# EAGLE design pc386ram-nobuf (EAGLE 7.7.0)
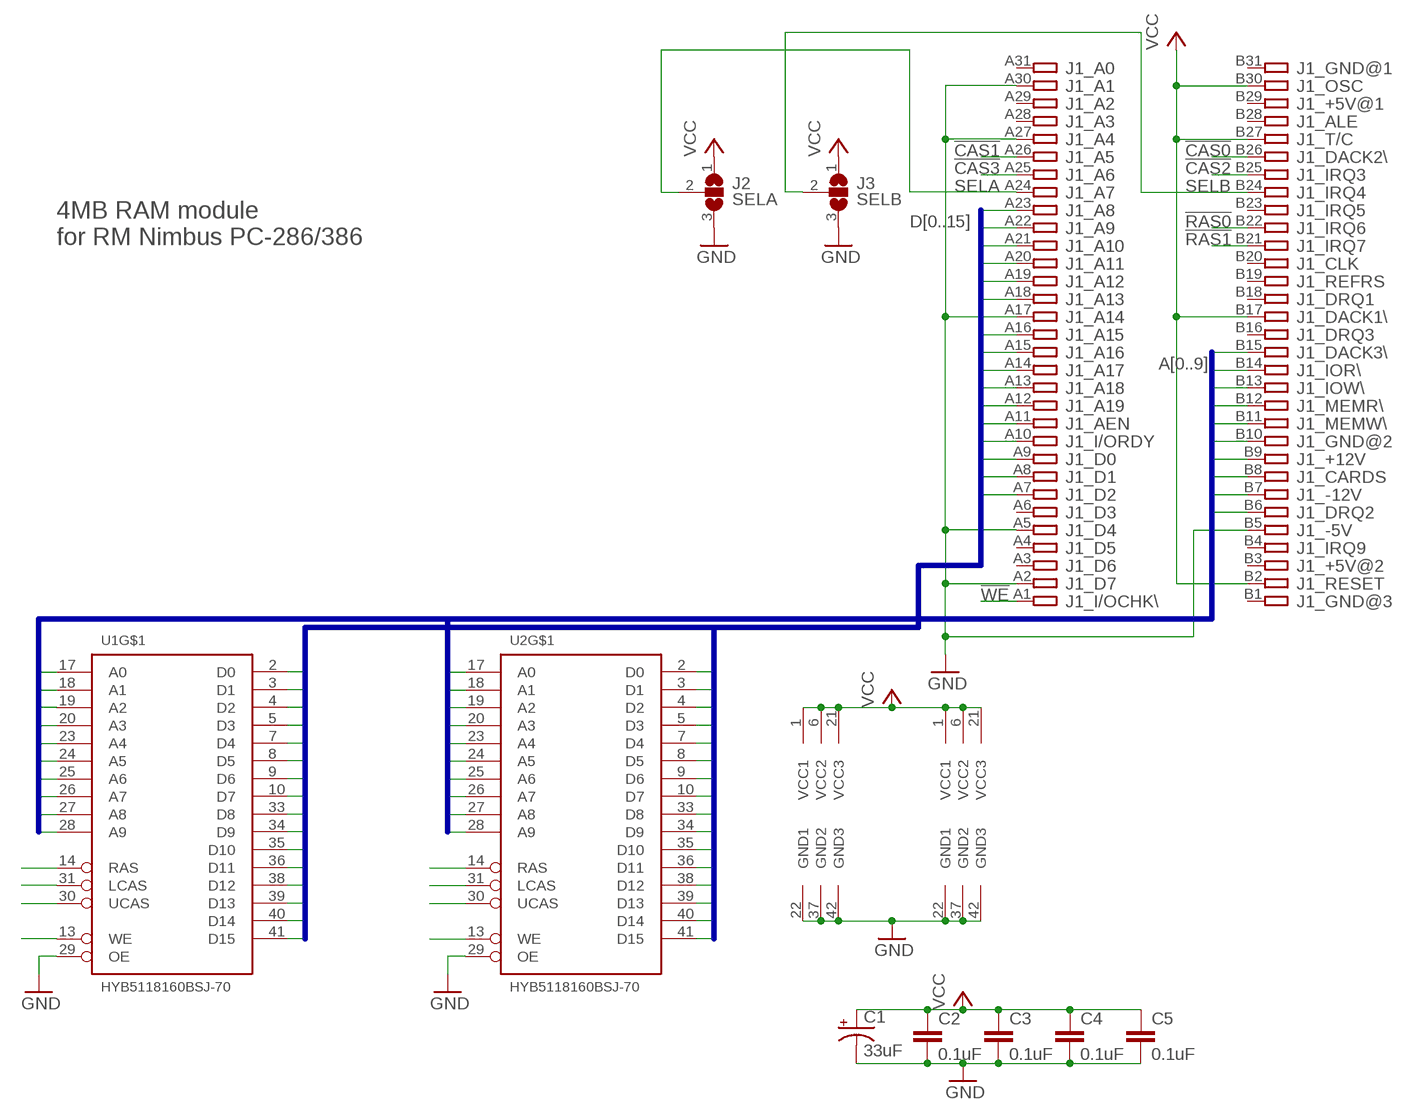
[diagram p0: schematic, sheet 1]

## Parts
C1  33uF  CPOL-USE2.5-7  [E2,5-7]
C2  0.1uF  C-EU050-024X044  [C050-024X044]
C3  0.1uF  C-EU050-024X044  [C050-024X044]
C4  0.1uF  C-EU050-024X044  [C050-024X044]
C5  0.1uF  C-EU050-024X044  [C050-024X044]
J1  PC-386 RAM slot  IBM8BIT  [IBM8BIT]
J2  SELA  SJ2W  [SJ_2]
J3  SELB  SJ2W  [SJ_2]
U1  HYB5118160BSJ-70  [SOJ-42]
U2  HYB5118160BSJ-70  [SOJ-42]

## Nets
!CAS0: J1.B26 U1.30(UCAS)
!CAS1: J1.A26 U1.31(LCAS)
!CAS2: J1.B25 U2.30(UCAS)
!CAS3: J1.A25 U2.31(LCAS)
!RAS0: J1.B22 U1.14(RAS)
!RAS1: J1.B21 U2.14(RAS)
!WE: J1.A1 U1.13(WE) U2.13(WE)
A0: J1.B6 U1.17(A0) U2.17(A0)
A1: J1.B7 U1.18(A1) U2.18(A1)
A2: J1.B8 U1.19(A2) U2.19(A2)
A3: J1.B9 U1.20(A3) U2.20(A3)
A4: J1.B10 U1.23(A4) U2.23(A4)
A5: J1.B11 U1.24(A5) U2.24(A5)
A6: J1.B12 U1.25(A6) U2.25(A6)
A7: J1.B13 U1.26(A7) U2.26(A7)
A8: J1.B14 U1.27(A8) U2.27(A8)
A9: J1.B15 U1.28(A9) U2.28(A9)
D0: J1.A7 U1.2(D0) U2.2(D0)
D1: J1.A8 U1.3(D1) U2.3(D1)
D2: J1.A9 U1.4(D2) U2.4(D2)
D3: J1.A10 U1.5(D3) U2.5(D3)
D4: J1.A11 U1.7(D4) U2.7(D4)
D5: J1.A12 U1.8(D5) U2.8(D5)
D6: J1.A13 U1.9(D6) U2.9(D6)
D7: J1.A14 U1.10(D7) U2.10(D7)
D8: J1.A15 U1.33(D8) U2.33(D8)
D9: J1.A16 U1.34(D9) U2.34(D9)
D10: J1.A18 U1.35(D10) U2.35(D10)
D11: J1.A19 U1.36(D11) U2.36(D11)
D12: J1.A20 U1.38(D12) U2.38(D12)
D13: J1.A21 U1.39(D13) U2.39(D13)
D14: J1.A22 U1.40(D14) U2.40(D14)
D15: J1.A23 U1.41(D15) U2.41(D15)
GND [power]: C1.- C2.2 C3.2 C4.2 C5.2 J1.A2 J1.A5 J1.A17 J1.A27 J1.A30 J1.B5 J2.3 J3.3 U1.22(GND1) U1.29(OE) U1.37(GND2) U1.42(GND3) U2.22(GND1) U2.29(OE) U2.37(GND2) U2.42(GND3)
SELA: J1.A24 J2.2
SELB: J1.B24 J3.2
VCC [power]: C1.+ C2.1 C3.1 C4.1 C5.1 J1.B2 J1.B17 J1.B27 J1.B30 J2.1 J3.1 U1.1(VCC1) U1.6(VCC2) U1.21(VCC3) U2.1(VCC1) U2.6(VCC2) U2.21(VCC3)
Unconnected: J1.A3 J1.A4 J1.A6 J1.A28 J1.A29 J1.A31 J1.B1 J1.B3 J1.B4 J1.B16 J1.B18 J1.B19 J1.B20 J1.B23 J1.B28 J1.B29 J1.B31

## Buses
D[0..15]
A[0..9]

## Notes on the sheet
- 4MB RAM module
  for RM Nimbus PC-286/386

## Library data of the parts
C1 = rcl:CPOL-US: POLARIZED CAPACITOR, American symbol
C2-C5 = rcl:C-EU: CAPACITOR, European symbol
J1 = con-pc:IBM8BIT: 8-bit CARD IBM/PC-AT
J2 J3 = jumper:SJ2W: SMD solder JUMPER
U1 U2 = pc386ram:HYB5118160BSJ: Siemens HYB5118160BSJ-50/-60/-70 1Mx16 DRAM The HYB5118160BSJ is a 16 MBit dynamic RAM organized as 1,048,576 words by 16 bits. The HYB5118160BSJ utilizes a submicron CMOS silicon gate process technology, as well as advanced circuit techniques to provide wide operating margins, both internally and for the system user. Multiplexed address inputs permit the HYB5118160BSJ to be packaged in a standard SOJ-42 400 mil plastic package. These packages provide high system bit densities and are compatible with commonly used automatic testing and insertion equipment. System-oriented features include single +5V (±10%) power supply, direct interfacing with high-performance logic device families such as Schottky TTL.

## Board
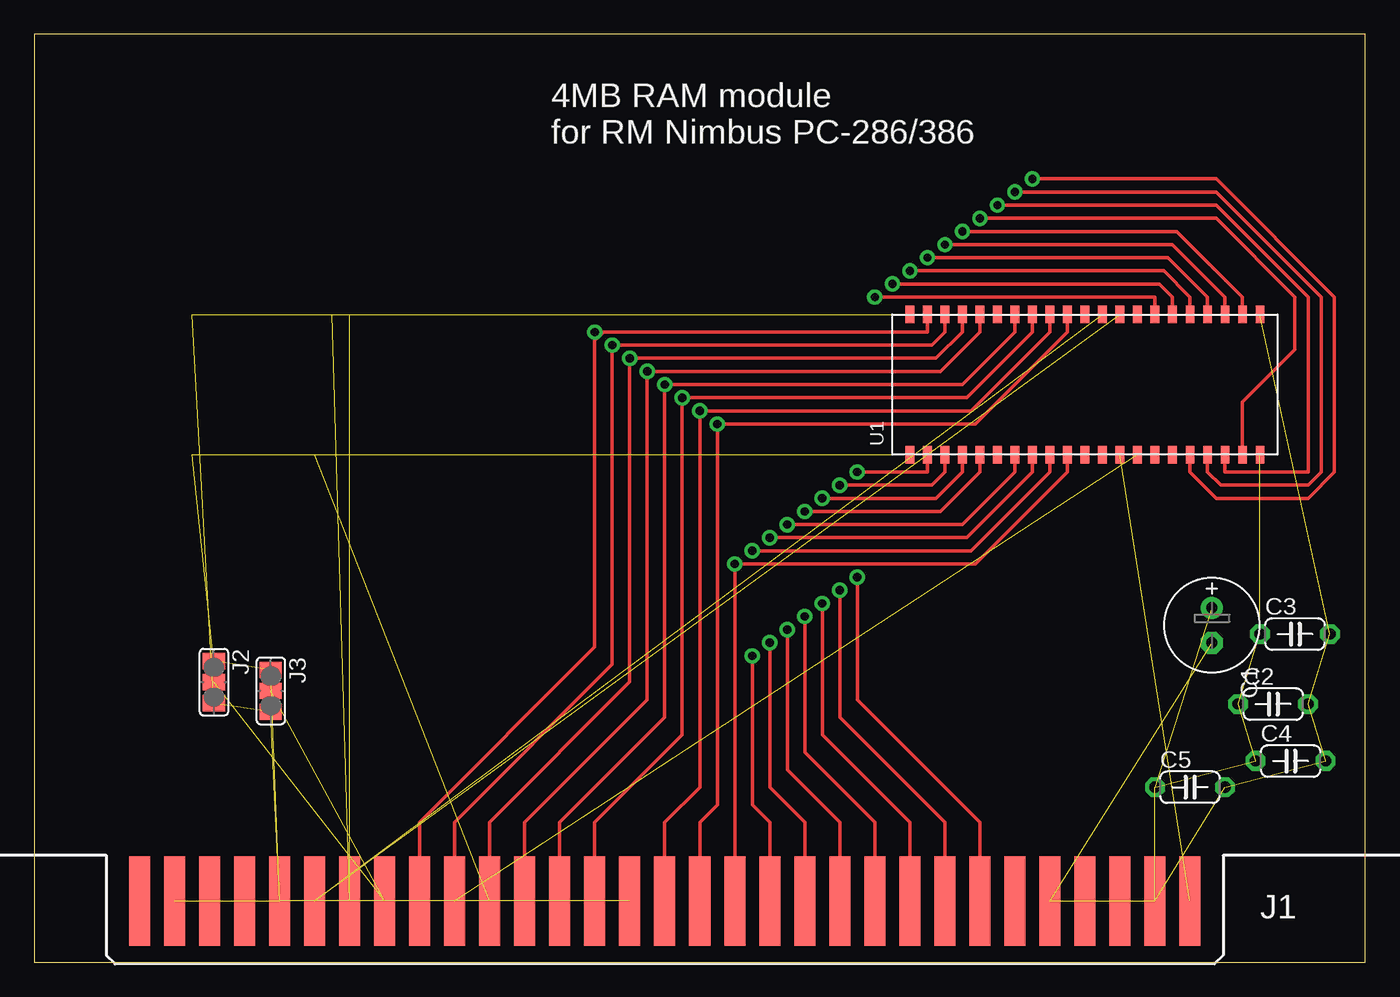
[diagram p1: board, top side]
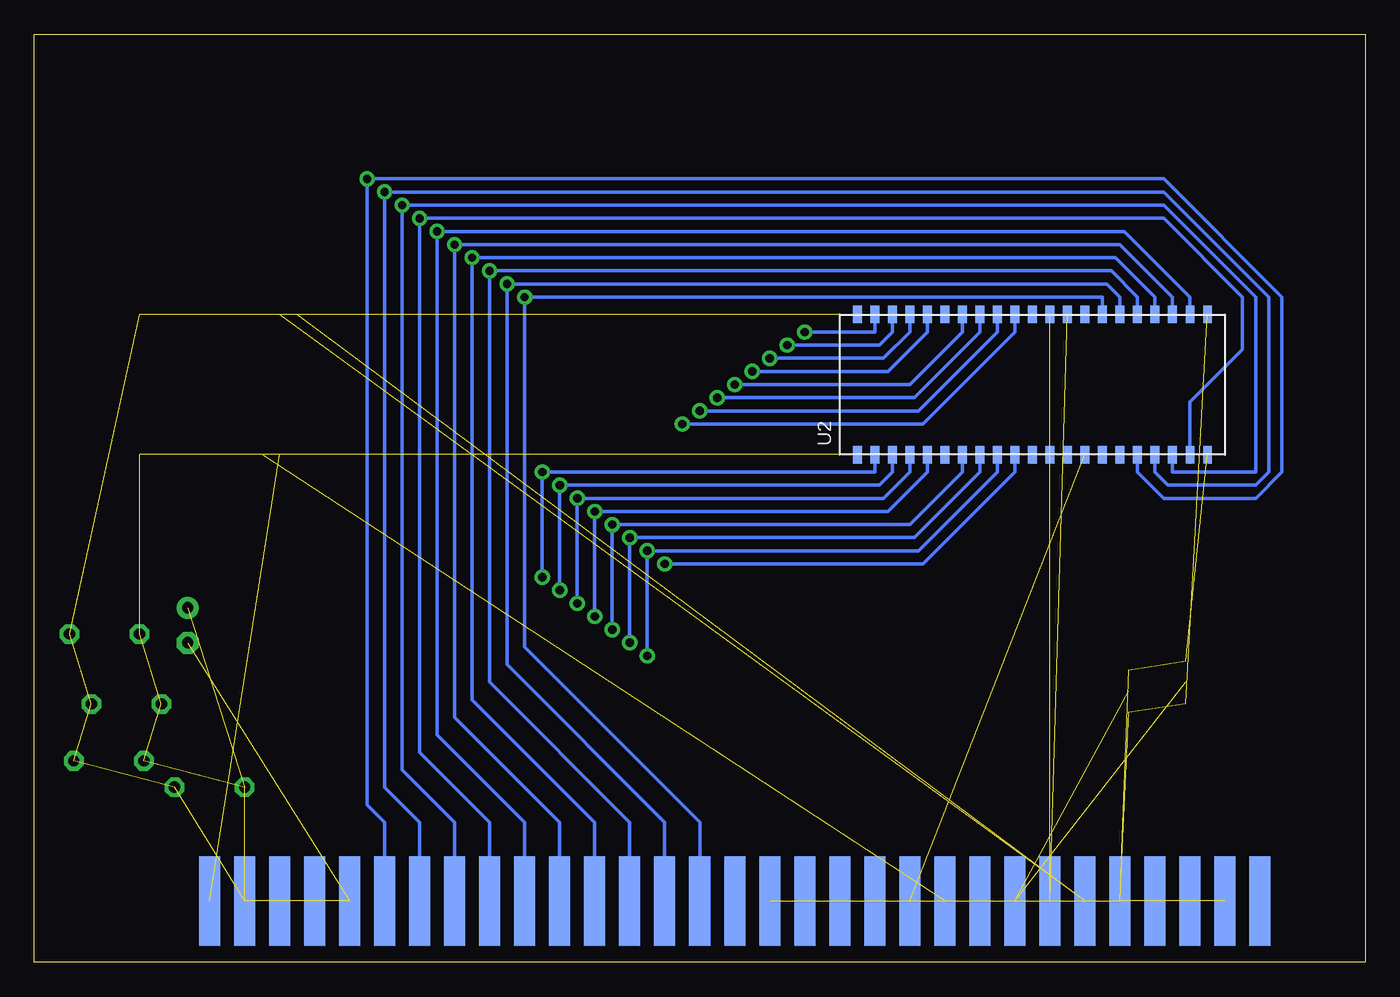
[diagram p2: board, bottom side, seen from below]

Size 96.52 x 67.31 mm. Coordinates in mm from the lower left corner, seen from the top.
Outline: 0,0 96.52,0 96.52,67.31 0,67.31 0,0
Copper layers (1*16): Top 0.035mm / dielectric 1.5mm / Bottom 0.035mm
Design rules "SparkFun": minimum track width 8mil, minimum drill 20mil, track to track 8mil, track to pad 8mil, pad to pad 8mil, via to via 8mil, smd to smd 8mil, copper to edge 10mil, drill to drill 8mil, minimum pad ring 12mil, minimum via ring 10mil, stop-mask expansion 4mil, vias tented up to drill 25mil, thermal gap 10mil

### Footprints (pad centres in the part's own frame; a part is rotated, then mirrored left to right if it is on the bottom)
E2,5-7 = drill 0.813 pad 1.6: + -1.27,0 | drill 0.813 pad 1.6 octagon: - 1.27,0
C050-024X044 = drill 0.813 octagon: 1 -2.54,0; 2 2.54,0
IBM8BIT = smd 1.524 x 6.477: A1 -25.4,5.08; A2 -27.94,5.08; A3 -30.48,5.08; A4 -33.02,5.08; A5 -35.56,5.08; A6 -38.1,5.08; A7 -40.64,5.08; A8 -43.18,5.08; A9 -45.72,5.08; A10 -48.26,5.08; A11 -50.8,5.08; A12 -53.34,5.08; A13 -55.88,5.08; A14 -58.42,5.08; A15 -60.96,5.08; A16 -63.5,5.08; A17 -66.04,5.08; A18 -68.58,5.08; A19 -71.12,5.08; A20 -73.66,5.08; A21 -76.2,5.08; A22 -78.74,5.08; A23 -81.28,5.08; A24 -83.82,5.08; A25 -86.36,5.08; A26 -88.9,5.08; A27 -91.44,5.08; A28 -93.98,5.08; A29 -96.52,5.08; A30 -99.06,5.08; A31 -101.6,5.08 | smd 1.524 x 6.477 bottom: B1 -25.4,5.08; B2 -27.94,5.08; B3 -30.48,5.08; B4 -33.02,5.08; B5 -35.56,5.08; B6 -38.1,5.08; B7 -40.64,5.08; B8 -43.18,5.08; B9 -45.72,5.08; B10 -48.26,5.08; B11 -50.8,5.08; B12 -53.34,5.08; B13 -55.88,5.08; B14 -58.42,5.08; B15 -60.96,5.08; B16 -63.5,5.08; B17 -66.04,5.08; B18 -68.58,5.08; B19 -71.12,5.08; B20 -73.66,5.08; B21 -76.2,5.08; B22 -78.74,5.08; B23 -81.28,5.08; B24 -83.82,5.08; B25 -86.36,5.08; B26 -88.9,5.08; B27 -91.44,5.08; B28 -93.98,5.08; B29 -96.52,5.08; B30 -99.06,5.08; B31 -101.6,5.08
SJ_2 = smd 1.168 x 1.6: 1 -1.524,0; 2 0,0; 3 1.524,0
SOJ-42 = smd 1.27 x 0.635: 1 0,25.4; 2 0,24.13; 3 0,22.86; 4 0,21.59; 5 0,20.32; 6 0,19.05; 7 0,17.78; 8 0,16.51; 9 0,15.24; 10 0,13.97; 11 0,12.7; 12 0,11.43; 13 0,10.16; 14 0,8.89; 15 0,7.62; 16 0,6.35; 17 0,5.08; 18 0,3.81; 19 0,2.54; 20 0,1.27; 21 0,0; 22 10.16,0; 23 10.16,1.27; 24 10.16,2.54; 25 10.16,3.81; 26 10.16,5.08; 27 10.16,6.35; 28 10.16,7.62; 29 10.16,8.89; 30 10.16,10.16; 31 10.16,11.43; 32 10.16,12.7; 33 10.16,13.97; 34 10.16,15.24; 35 10.16,16.51; 36 10.16,17.78; 37 10.16,19.05; 38 10.16,20.32; 39 10.16,21.59; 40 10.16,22.86; 41 10.16,24.13; 42 10.16,25.4

### Placement (x,y rotation side)
C1  85.41,24.45 270 top
C2  89.85,18.73 0 top
C3  91.44,23.81 0 top
C4  91.12,14.61 0 top
C5  83.82,12.7 0 top
J1  109.22,-0.64 0 top
J2  13.02,20.32 270 top
J3  17.14,19.68 270 top
U1  88.9,36.83 90 top
U2  11.43,36.83 90 bottom

### Tracks (layer width: path | path; a pad name or v marks a point on that pad's centre or on a via)
!CAS0  (1 unrouted)
!CAS1  (1 unrouted)
!CAS2  (1 unrouted)
!CAS3  (1 unrouted)
!RAS0  (1 unrouted)
!RAS1  (1 unrouted)
!WE  (2 unrouted)
A0  (via drill 0.6)
  Top 0.254: v72.39,56.83 85.72,56.83 94.3,48.26 94.3,35.56 92.39,33.66 85.72,33.66 83.82,35.56 U1.17
  Bottom 0.254: U2.17 16.51,35.56 14.61,33.66 7.94,33.66 6.03,35.56 6.03,48.26 14.61,56.83 v72.39,56.83 72.39,11.43 71.12,10.16 J1.B6
A1  (via drill 0.6)
  Top 0.254: v71.12,55.88 85.72,55.88 93.34,48.26 93.34,35.56 92.39,34.61 86.04,34.61 85.09,35.56 U1.18
  Bottom 0.254: U2.18 15.24,35.56 14.29,34.61 7.94,34.61 6.99,35.56 6.99,48.26 14.61,55.88 v71.12,55.88 71.12,12.7 68.58,10.16 J1.B7
A2  (via drill 0.6)
  Top 0.254: U1.19 86.36,35.56 92.39,35.56 92.39,48.26 85.72,54.93 v69.85,54.93
  Bottom 0.254: U2.19 13.97,35.56 7.94,35.56 7.94,48.26 14.61,54.93 v69.85,54.93 69.85,13.97 66.04,10.16 J1.B8
A3  (via drill 0.6)
  Top 0.254: U1.20 87.63,40.64 91.44,44.45 91.44,48.26 85.72,53.98 v68.58,53.98
  Bottom 0.254: U2.20 12.7,40.64 8.89,44.45 8.89,48.26 14.61,53.98 v68.58,53.98 68.58,15.24 63.5,10.16 J1.B9
A4  (via drill 0.6)
  Top 0.254: U1.23 87.63,48.26 82.87,53.02 v67.31,53.02
  Bottom 0.254: U2.23 12.7,48.26 17.46,53.02 v67.31,53.02 67.31,16.51 60.96,10.16 J1.B10
A5  (via drill 0.6)
  Top 0.254: v66.04,52.07 82.55,52.07 86.36,48.26 U1.24
  Bottom 0.254: U2.24 13.97,48.26 17.78,52.07 v66.04,52.07 66.04,17.78 58.42,10.16 J1.B11
A6  (via drill 0.6)
  Top 0.254: U1.25 85.09,48.26 82.23,51.12 v64.77,51.12
  Bottom 0.254: U2.25 15.24,48.26 18.1,51.12 v64.77,51.12 64.77,19.05 55.88,10.16 J1.B12
A7  (via drill 0.6)
  Top 0.254: v63.5,50.16 81.92,50.16 83.82,48.26 U1.26
  Bottom 0.254: U2.26 16.51,48.26 18.41,50.16 v63.5,50.16 63.5,20.32 53.34,10.16 J1.B13
A8  (via drill 0.6)
  Top 0.254: U1.27 82.55,48.26 81.6,49.21 v62.23,49.21
  Bottom 0.254: U2.27 17.78,48.26 18.73,49.21 v62.23,49.21 62.23,21.59 50.8,10.16 J1.B14
A9  (via drill 0.6)
  Top 0.254: U1.28 81.28,48.26 v60.96,48.26
  Bottom 0.254: U2.28 19.05,48.26 v60.96,48.26 60.96,22.86 48.26,10.16 J1.B15
D0  (via drill 0.6)
  Top 0.254: v59.69,35.56 64.77,35.56 U1.2 | J1.A7 68.58,10.16 59.69,19.05 v59.69,27.94
  Bottom 0.254: U2.2 35.56,35.56 v59.69,35.56 v59.69,27.94
D1  (via drill 0.6)
  Top 0.254: v58.42,34.61 65.09,34.61 66.04,35.56 U1.3 | J1.A8 66.04,10.16 58.42,17.78 v58.42,26.99
  Bottom 0.254: U2.3 34.29,35.56 35.24,34.61 v58.42,34.61 v58.42,26.99
D2  (via drill 0.6)
  Top 0.254: v57.15,33.66 65.41,33.66 67.31,35.56 U1.4 | J1.A9 63.5,10.16 57.15,16.51 v57.15,26.04
  Bottom 0.254: U2.4 33.02,35.56 34.92,33.66 v57.15,33.66 v57.15,26.04
D3  (via drill 0.6)
  Top 0.254: U1.5 68.58,35.56 65.72,32.7 v55.88,32.7 | J1.A10 60.96,10.16 55.88,15.24 v55.88,25.08
  Bottom 0.254: U2.5 31.75,35.56 34.61,32.7 v55.88,32.7 v55.88,25.08
D4  (via drill 0.6)
  Top 0.254: U1.7 71.12,35.56 67.31,31.75 v54.61,31.75 | J1.A11 58.42,10.16 54.61,13.97 v54.61,24.13
  Bottom 0.254: U2.7 29.21,35.56 33.02,31.75 v54.61,31.75 v54.61,24.13
D5  (via drill 0.6)
  Top 0.254: U1.8 72.39,35.56 67.63,30.8 v53.34,30.8 | J1.A12 55.88,10.16 53.34,12.7 v53.34,23.18
  Bottom 0.254: U2.8 27.94,35.56 32.7,30.8 v53.34,30.8 v53.34,23.18
D6  (via drill 0.6)
  Top 0.254: U1.9 73.66,35.56 67.94,29.84 v52.07,29.84 | J1.A13 53.34,10.16 52.07,11.43 v52.07,22.23
  Bottom 0.254: U2.9 26.67,35.56 32.38,29.84 v52.07,29.84 v52.07,22.23
D7  (via drill 0.6)
  Top 0.254: U1.10 74.93,35.56 68.26,28.89 v50.8,28.89 J1.A14
  Bottom 0.254: v50.8,28.89 32.07,28.89 25.4,35.56 U2.10
D8  (via drill 0.6)
  Top 0.254: U1.33 74.93,45.72 68.26,39.05 v49.53,39.05 49.53,11.43 48.26,10.16 J1.A15
  Bottom 0.254: v49.53,39.05 32.07,39.05 25.4,45.72 U2.33
D9  (via drill 0.6)
  Top 0.254: U1.34 73.66,45.72 67.94,40.01 v48.26,40.01 48.26,12.7 45.72,10.16 J1.A16
  Bottom 0.254: v48.26,40.01 32.38,40.01 26.67,45.72 U2.34
D10  (via drill 0.6)
  Top 0.254: U1.35 72.39,45.72 67.63,40.96 v46.99,40.96 46.99,16.51 40.64,10.16 J1.A18
  Bottom 0.254: v46.99,40.96 32.7,40.96 27.94,45.72 U2.35
D11  (via drill 0.6)
  Top 0.254: U1.36 71.12,45.72 67.31,41.91 v45.72,41.91 45.72,17.78 38.1,10.16 J1.A19
  Bottom 0.254: v45.72,41.91 33.02,41.91 29.21,45.72 U2.36
D12  (via drill 0.6)
  Top 0.254: U1.38 68.58,45.72 65.72,42.86 v44.45,42.86 44.45,19.05 35.56,10.16 J1.A20
  Bottom 0.254: v44.45,42.86 34.61,42.86 31.75,45.72 U2.38
D13  (via drill 0.6)
  Top 0.254: U1.39 67.31,45.72 65.41,43.81 v43.18,43.81 43.18,20.32 33.02,10.16 J1.A21
  Bottom 0.254: v43.18,43.81 34.92,43.81 33.02,45.72 U2.39
D14  (via drill 0.6)
  Top 0.254: U1.40 66.04,45.72 65.09,44.77 v41.91,44.77 41.91,21.59 30.48,10.16 J1.A22
  Bottom 0.254: v41.91,44.77 35.24,44.77 34.29,45.72 U2.40
D15  (via drill 0.6)
  Top 0.254: U1.41 64.77,45.72 41.27,45.72 | 41.27,45.72 v40.64,45.72 | J1.A23 27.94,10.16 40.64,22.86 40.64,45.09 41.27,45.72
  Bottom 0.254: v40.64,45.72 35.56,45.72 U2.41
GND  (20 unrouted)
SELA  (1 unrouted)
SELB  (1 unrouted)
VCC  (16 unrouted)

### Text on the board
tNames: 4MB RAM module / for RM Nimbus PC-286/386